# Altium schematic sheet connectors.SchDoc
size A3
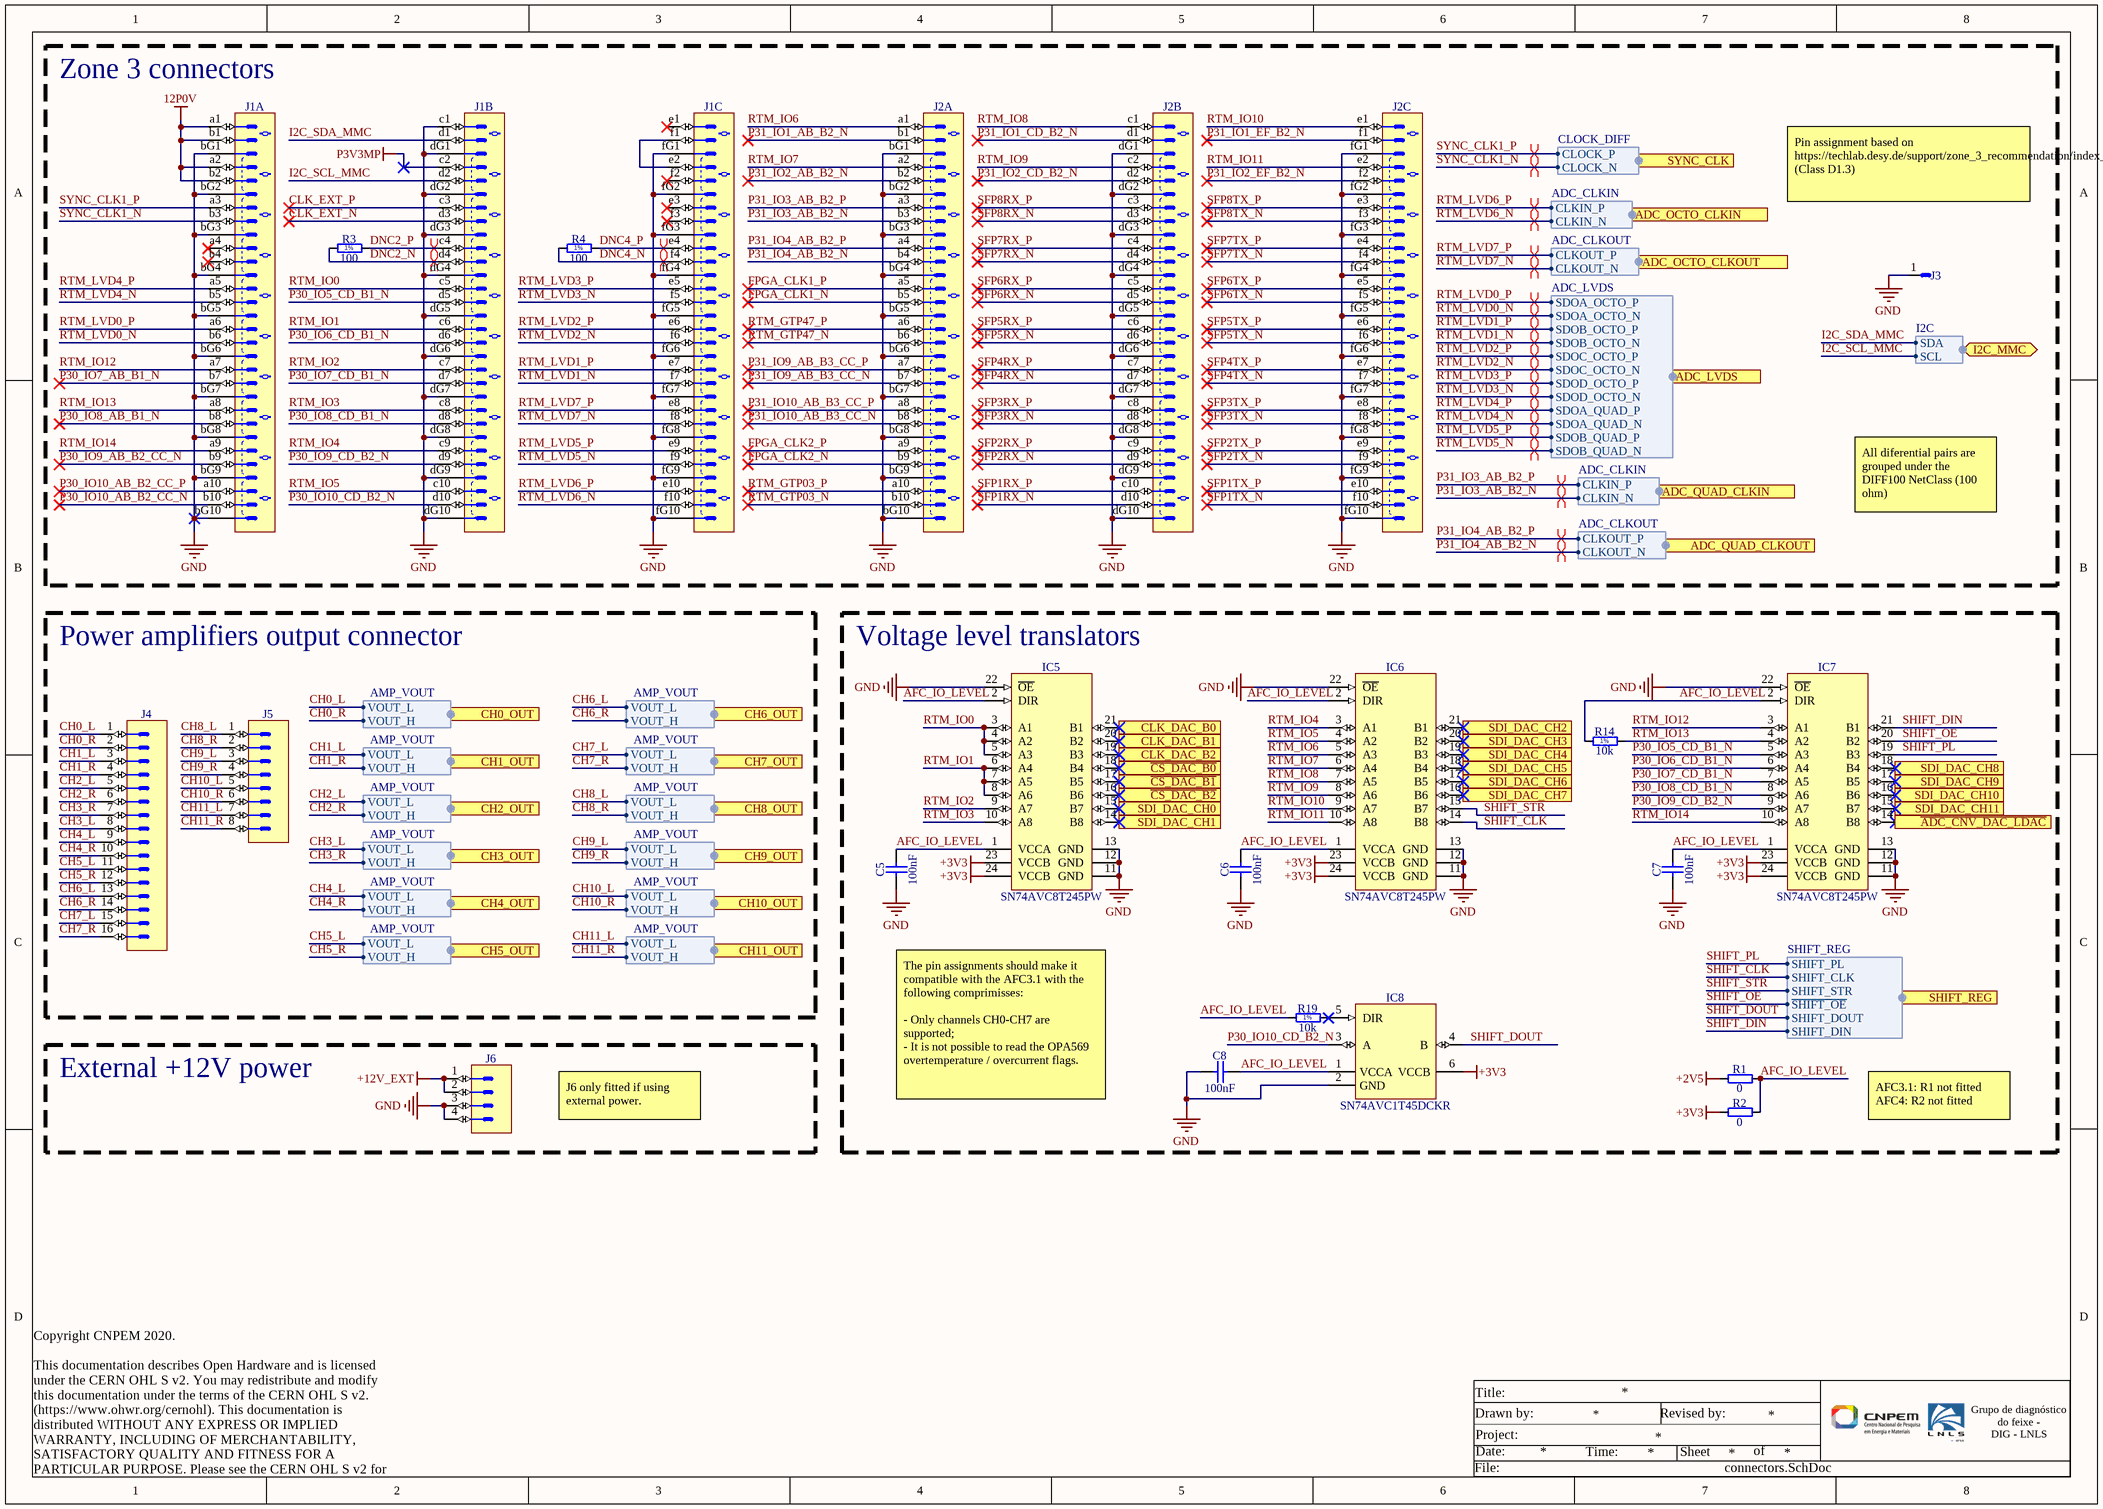
[diagram p0: connectors.SchDoc]

## Parts
C5  100nF  [CAPC1608X87N]
C6  100nF  [CAPC1608X87N]
C7  100nF  [CAPC1608X87N]
C8  100nF  [CAPC1608X87N]
IC5  SN74AVC8T245PW  [SOP65P640X120-24N]
IC6  SN74AVC8T245PW  [SOP65P640X120-24N]
IC7  SN74AVC8T245PW  [SOP65P640X120-24N]
IC8  SN74AVC1T45DCKR  [SOT65P210X110-6N]
J1  Advanced TCA  [TYCO_6469183-1]  (value not drawn)  (parts A,B,C of 3)
J2  Advanced TCA  [TYCO_6469183-1]  (value not drawn)  (parts A,B,C of 3)
J3  (no value)  [TYCO_1469265-1]
J4  Euroblock  [MOLEX_39502-1016]  (value not drawn)
J5  Euroblock  [MOLEX_39502-1008]  (value not drawn)
J6  Euroblock  [MOLEX_39502-1004]  (value not drawn)
R1  0  [RESC1608X55N]
R2  0  [RESC1608X55N]
R3  100  [RESC1608X55N]
R4  100  [RESC1608X55N]
R14  10k  [RESC1608X55N]
R19  10k  [RESC1608X55N]

## Blocks framed on the sheet
Zone 3 connectors: J1-J3 R3 R4
Power amplifiers output connector: J4 J5
Voltage level translators: C5-C8 IC5-IC8 R1 R2 R14 R19
External +12V power: J6

## Ports
ADC_LVDS (harness ADC_LVDS), ADC_OCTO_CLKIN (harness ADC_CLKIN), ADC_OCTO_CLKOUT (harness ADC_CLKOUT), ADC_QUAD_CLKIN (harness ADC_CLKIN), ADC_QUAD_CLKOUT (harness ADC_CLKOUT), CH0_OUT (harness AMP_VOUT), CH1_OUT (harness AMP_VOUT), CH2_OUT (harness AMP_VOUT), CH3_OUT (harness AMP_VOUT), CH4_OUT (harness AMP_VOUT), CH5_OUT (harness AMP_VOUT), CH6_OUT (harness AMP_VOUT), CH7_OUT (harness AMP_VOUT), CH8_OUT (harness AMP_VOUT), CH9_OUT (harness AMP_VOUT), CH10_OUT (harness AMP_VOUT), CH11_OUT (harness AMP_VOUT), CLK_DAC_B0 (out), CLK_DAC_B1 (out), CLK_DAC_B2 (out), I2C_MMC (bidir, harness I2C), SDI_DAC_CH0 (out), SDI_DAC_CH1 (out), SDI_DAC_CH2 (out), SDI_DAC_CH3 (out), SDI_DAC_CH4 (out), SDI_DAC_CH5 (out), SDI_DAC_CH6 (out), SDI_DAC_CH7 (out), SDI_DAC_CH8 (out), SDI_DAC_CH9 (out), SDI_DAC_CH10 (out), SDI_DAC_CH11 (out), SHIFT_REG (out, harness SHIFT_REG), SYNC_CLK (harness CLOCK_DIFF), ~{ADC_CNV_DAC_LDAC} (out), ~{CS_DAC_B0} (out), ~{CS_DAC_B1} (out), ~{CS_DAC_B2} (out)

## Harnesses
CLOCK_DIFF: CLOCK_P, CLOCK_N
I2C: SDA, SCL
AMP_VOUT: VOUT_L, VOUT_H
SHIFT_REG: SHIFT_PL, SHIFT_CLK, SHIFT_STR, ~{SHIFT_OE}, SHIFT_DOUT, SHIFT_DIN
ADC_LVDS: SDOA_OCTO_P, SDOA_OCTO_N, SDOB_OCTO_P, SDOB_OCTO_N, SDOC_OCTO_P, SDOC_OCTO_N, SDOD_OCTO_P, SDOD_OCTO_N, SDOA_QUAD_P, SDOA_QUAD_N, SDOB_QUAD_P, SDOB_QUAD_N
ADC_CLKIN: CLKIN_P, CLKIN_N
ADC_CLKOUT: CLKOUT_P, CLKOUT_N

## Nets
12P0V: J1.a1 J1.a2 J1.b1 J1.b2
+2V5: R1.1
+3V3: IC5.23(VCCB) IC5.24(VCCB) IC6.23(VCCB) IC6.24(VCCB) IC7.23(VCCB) IC7.24(VCCB) IC8.6(VCCB) R2.1
+12V_EXT: J6.1 J6.2
GND: C5.1 C6.1 C7.1 C8.1 IC5.11(GND) IC5.12(GND) IC5.13(GND) IC5.22(~{OE}) IC6.11(GND) IC6.12(GND) IC6.13(GND) IC6.22(~{OE}) IC7.11(GND) IC7.12(GND) IC7.13(GND) IC7.22(~{OE}) IC8.2(GND) J1.bG1 J1.bG2 J1.bG3 J1.bG4 J1.bG5 J1.bG6 J1.bG7 J1.bG8 J1.bG9 J1.bG10 J1.c1 J1.dG1 J1.dG2 J1.dG3 J1.dG4 J1.dG5 J1.dG6 J1.dG7 J1.dG8 J1.dG9 J1.dG10 J1.fG1 J1.fG2 J1.fG3 J1.fG4 J1.fG5 J1.fG6 J1.fG7 J1.fG8 J1.fG9 J1.fG10 J2.bG1 J2.bG2 J2.bG3 J2.bG4 J2.bG5 J2.bG6 J2.bG7 J2.bG8 J2.bG9 J2.bG10 J2.dG1 J2.dG2 J2.dG3 J2.dG4 J2.dG5 J2.dG6 J2.dG7 J2.dG8 J2.dG9 J2.dG10 J2.fG1 J2.fG2 J2.fG3 J2.fG4 J2.fG5 J2.fG6 J2.fG7 J2.fG8 J2.fG9 J2.fG10 J3.1 J6.3 J6.4
P3V3MP: J1.c2
~{ADC_CNV_DAC_LDAC}: IC7.14(B8) ; port ~{ADC_CNV_DAC_LDAC}
AFC_IO_LEVEL: C5.2 C6.2 C7.2 C8.2 IC5.1(VCCA) IC5.2(DIR) IC6.1(VCCA) IC6.2(DIR) IC7.1(VCCA) IC7.2(DIR) IC8.1(VCCA) R1.2 R2.2 R14.1 R19.1
~{CS_DAC_B0}: IC5.18(B4) ; port ~{CS_DAC_B0}
~{CS_DAC_B1}: IC5.17(B5) ; port ~{CS_DAC_B1}
~{CS_DAC_B2}: IC5.16(B6) ; port ~{CS_DAC_B2}
CH0_L: J4.1 ; port CH0_OUT.VOUT_L
CH0_R: J4.2 ; port CH0_OUT.VOUT_H
CH1_L: J4.3 ; port CH1_OUT.VOUT_L
CH1_R: J4.4 ; port CH1_OUT.VOUT_H
CH2_L: J4.5 ; port CH2_OUT.VOUT_L
CH2_R: J4.6 ; port CH2_OUT.VOUT_H
CH3_L: J4.8 ; port CH3_OUT.VOUT_L
CH3_R: J4.7 ; port CH3_OUT.VOUT_H
CH4_L: J4.9 ; port CH4_OUT.VOUT_L
CH4_R: J4.10 ; port CH4_OUT.VOUT_H
CH5_L: J4.11 ; port CH5_OUT.VOUT_L
CH5_R: J4.12 ; port CH5_OUT.VOUT_H
CH6_L: J4.13 ; port CH6_OUT.VOUT_L
CH6_R: J4.14 ; port CH6_OUT.VOUT_H
CH7_L: J4.15 ; port CH7_OUT.VOUT_L
CH7_R: J4.16 ; port CH7_OUT.VOUT_H
CH8_L: J5.1 ; port CH8_OUT.VOUT_L
CH8_R: J5.2 ; port CH8_OUT.VOUT_H
CH9_L: J5.3 ; port CH9_OUT.VOUT_L
CH9_R: J5.4 ; port CH9_OUT.VOUT_H
CH10_L: J5.5 ; port CH10_OUT.VOUT_L
CH10_R: J5.6 ; port CH10_OUT.VOUT_H
CH11_L: J5.7 ; port CH11_OUT.VOUT_L
CH11_R: J5.8 ; port CH11_OUT.VOUT_H
CLK_DAC_B0: IC5.21(B1) ; port CLK_DAC_B0
CLK_DAC_B1: IC5.20(B2) ; port CLK_DAC_B1
CLK_DAC_B2: IC5.19(B3) ; port CLK_DAC_B2
CLK_EXT_N: J1.d3
CLK_EXT_P: J1.c3
DNC2_N: J1.d4 R3.1
DNC2_P: J1.c4 R3.2
DNC4_N: J1.f4 R4.1
DNC4_P: J1.e4 R4.2
FPGA_CLK1_N: J2.b5
FPGA_CLK1_P: J2.a5
FPGA_CLK2_N: J2.b9
FPGA_CLK2_P: J2.a9
I2C_SCL_MMC: J1.d2 ; port I2C_MMC.SCL
I2C_SDA_MMC: J1.d1 ; port I2C_MMC.SDA
P30_IO5_CD_B1_N: IC7.5(A3) J1.d5
P30_IO6_CD_B1_N: IC7.6(A4) J1.d6
P30_IO7_AB_B1_N: J1.b7
P30_IO7_CD_B1_N: IC7.7(A5) J1.d7
P30_IO8_AB_B1_N: J1.b8
P30_IO8_CD_B1_N: IC7.8(A6) J1.d8
P30_IO9_AB_B2_CC_N: J1.b9
P30_IO9_CD_B2_N: IC7.9(A7) J1.d9
P30_IO10_AB_B2_CC_N: J1.b10
P30_IO10_AB_B2_CC_P: J1.a10
P30_IO10_CD_B2_N: IC8.3(A) J1.d10
P31_IO1_AB_B2_N: J2.b1
P31_IO1_CD_B2_N: J2.d1
P31_IO1_EF_B2_N: J2.f1
P31_IO2_AB_B2_N: J2.b2
P31_IO2_CD_B2_N: J2.d2
P31_IO2_EF_B2_N: J2.f2
P31_IO3_AB_B2_N: J2.b3 ; port ADC_QUAD_CLKIN.CLKIN_N
P31_IO3_AB_B2_P: J2.a3 ; port ADC_QUAD_CLKIN.CLKIN_P
P31_IO4_AB_B2_N: J2.b4 ; port ADC_QUAD_CLKOUT.CLKOUT_N
P31_IO4_AB_B2_P: J2.a4 ; port ADC_QUAD_CLKOUT.CLKOUT_P
P31_IO9_AB_B3_CC_N: J2.b7
P31_IO9_AB_B3_CC_P: J2.a7
P31_IO10_AB_B3_CC_N: J2.b8
P31_IO10_AB_B3_CC_P: J2.a8
RTM_GTP03_N: J2.b10
RTM_GTP03_P: J2.a10
RTM_GTP47_N: J2.b6
RTM_GTP47_P: J2.a6
RTM_IO0: IC5.3(A1) IC5.4(A2) IC5.5(A3) J1.c5
RTM_IO1: IC5.6(A4) IC5.7(A5) IC5.8(A6) J1.c6
RTM_IO2: IC5.9(A7) J1.c7
RTM_IO3: IC5.10(A8) J1.c8
RTM_IO4: IC6.3(A1) J1.c9
RTM_IO5: IC6.4(A2) J1.c10
RTM_IO6: IC6.5(A3) J2.a1
RTM_IO7: IC6.6(A4) J2.a2
RTM_IO8: IC6.7(A5) J2.c1
RTM_IO9: IC6.8(A6) J2.c2
RTM_IO10: IC6.9(A7) J2.e1
RTM_IO11: IC6.10(A8) J2.e2
RTM_IO12: IC7.3(A1) J1.a7
RTM_IO13: IC7.4(A2) J1.a8 R14.2
RTM_IO14: IC7.10(A8) J1.a9
RTM_LVD0_N: J1.b6 ; port ADC_LVDS.SDOA_OCTO_N
RTM_LVD0_P: J1.a6 ; port ADC_LVDS.SDOA_OCTO_P
RTM_LVD1_N: J1.f7 ; port ADC_LVDS.SDOB_OCTO_N
RTM_LVD1_P: J1.e7 ; port ADC_LVDS.SDOB_OCTO_P
RTM_LVD2_N: J1.f6 ; port ADC_LVDS.SDOC_OCTO_N
RTM_LVD2_P: J1.e6 ; port ADC_LVDS.SDOC_OCTO_P
RTM_LVD3_N: J1.f5 ; port ADC_LVDS.SDOD_OCTO_N
RTM_LVD3_P: J1.e5 ; port ADC_LVDS.SDOD_OCTO_P
RTM_LVD4_N: J1.b5 ; port ADC_LVDS.SDOA_QUAD_N
RTM_LVD4_P: J1.a5 ; port ADC_LVDS.SDOA_QUAD_P
RTM_LVD5_N: J1.f9 ; port ADC_LVDS.SDOB_QUAD_N
RTM_LVD5_P: J1.e9 ; port ADC_LVDS.SDOB_QUAD_P
RTM_LVD6_N: J1.f10 ; port ADC_OCTO_CLKIN.CLKIN_N
RTM_LVD6_P: J1.e10 ; port ADC_OCTO_CLKIN.CLKIN_P
RTM_LVD7_N: J1.f8 ; port ADC_OCTO_CLKOUT.CLKOUT_N
RTM_LVD7_P: J1.e8 ; port ADC_OCTO_CLKOUT.CLKOUT_P
~{SHIFT_OE}: IC7.20(B2) ; port SHIFT_REG.~{SHIFT_OE}
SDI_DAC_CH0: IC5.15(B7) ; port SDI_DAC_CH0
SDI_DAC_CH1: IC5.14(B8) ; port SDI_DAC_CH1
SDI_DAC_CH2: IC6.21(B1) ; port SDI_DAC_CH2
SDI_DAC_CH3: IC6.20(B2) ; port SDI_DAC_CH3
SDI_DAC_CH4: IC6.19(B3) ; port SDI_DAC_CH4
SDI_DAC_CH5: IC6.18(B4) ; port SDI_DAC_CH5
SDI_DAC_CH6: IC6.17(B5) ; port SDI_DAC_CH6
SDI_DAC_CH7: IC6.16(B6) ; port SDI_DAC_CH7
SDI_DAC_CH8: IC7.18(B4) ; port SDI_DAC_CH8
SDI_DAC_CH9: IC7.17(B5) ; port SDI_DAC_CH9
SDI_DAC_CH10: IC7.16(B6) ; port SDI_DAC_CH10
SDI_DAC_CH11: IC7.15(B7) ; port SDI_DAC_CH11
SFP1RX_N: J2.d10
SFP1RX_P: J2.c10
SFP1TX_N: J2.f10
SFP1TX_P: J2.e10
SFP2RX_N: J2.d9
SFP2RX_P: J2.c9
SFP2TX_N: J2.f9
SFP2TX_P: J2.e9
SFP3RX_N: J2.d8
SFP3RX_P: J2.c8
SFP3TX_N: J2.f8
SFP3TX_P: J2.e8
SFP4RX_N: J2.d7
SFP4RX_P: J2.c7
SFP4TX_N: J2.f7
SFP4TX_P: J2.e7
SFP5RX_N: J2.d6
SFP5RX_P: J2.c6
SFP5TX_N: J2.f6
SFP5TX_P: J2.e6
SFP6RX_N: J2.d5
SFP6RX_P: J2.c5
SFP6TX_N: J2.f5
SFP6TX_P: J2.e5
SFP7RX_N: J2.d4
SFP7RX_P: J2.c4
SFP7TX_N: J2.f4
SFP7TX_P: J2.e4
SFP8RX_N: J2.d3
SFP8RX_P: J2.c3
SFP8TX_N: J2.f3
SFP8TX_P: J2.e3
SHIFT_CLK: IC6.14(B8) ; port SHIFT_REG.SHIFT_CLK
SHIFT_DIN: IC7.21(B1) ; port SHIFT_REG.SHIFT_DIN
SHIFT_DOUT: IC8.4(B) ; port SHIFT_REG.SHIFT_DOUT
SHIFT_PL: IC7.19(B3) ; port SHIFT_REG.SHIFT_PL
SHIFT_STR: IC6.15(B7) ; port SHIFT_REG.SHIFT_STR
SYNC_CLK1_N: J1.b3 ; port SYNC_CLK.CLOCK_N
SYNC_CLK1_P: J1.a3 ; port SYNC_CLK.CLOCK_P
NetIC8_5: IC8.5(DIR) R19.2
NetJ1_e2: J1.e2 J1.f1

Not connected (* = marked no-connect by the designer): J1 a4* b4* e1* e3* f2* f3*

## Layout directives
differential pair; differential pair class DIFF100: DNC2_N, DNC2_P, DNC4_N, DNC4_P, P31_IO3_AB_B2_N, P31_IO3_AB_B2_P, P31_IO4_AB_B2_N, P31_IO4_AB_B2_P, RTM_LVD0_N, RTM_LVD0_P, RTM_LVD1_N, RTM_LVD1_P, RTM_LVD2_N, RTM_LVD2_P, RTM_LVD3_N, RTM_LVD3_P, RTM_LVD4_N, RTM_LVD4_P, RTM_LVD5_N, RTM_LVD5_P, RTM_LVD6_N, RTM_LVD6_P, RTM_LVD7_N, RTM_LVD7_P, SYNC_CLK1_N, SYNC_CLK1_P

## Notes on the sheet
- Pin assignment based on https://techlab.desy.de/support/zone_3_recommendation/index_eng.html
  (Class D1.3)
- All diferential pairs are grouped under the DIFF100 NetClass (100 ohm)
- J6 only fitted if using external power.
- The pin assignments should make it compatible with the AFC3.1 with the following comprimisses:
  - Only channels CH0-CH7 are supported;
  - It is not possible to read the OPA569 overtemperature / overcurrent flags.
- AFC3.1: R1 not fitted
  AFC4: R2 not fitted
- Title:
- Date:
- Project:
- Drawn by:
- Time:
- Revised by:
- Sheet
- of
- Grupo de diagnóstico do feixe -
  DIG - LNLS
- Copyright CNPEM 2020.
  This documentation describes Open Hardware and is licensed under the CERN OHL S v2. You may redistribute and modify this documentation under the terms of the CERN OHL S v2. (https://www.ohwr.org/cernohl). This documentation is distributed WITHOUT ANY EXPRESS OR IMPLIED WARRANTY, INCLUDING OF MERCHANTABILITY, SATISFACTORY QUALITY AND FITNESS FOR A PARTICULAR PURPOSE. Please see the CERN OHL S v2 for applicable conditions.
- File:
- (in symbol R0603_10K_1%_0.1W_100PPM) 1%
- (in symbol R0603_100R_1%_0.1W_100PPM) 1%

## Library data of the parts
C5-C8 = CC0603_100NF_50V_10%_X7R: Non-polarised capacitor; Part Description: SMD Multilayer Chip Ceramic Capacitor; Manufacturer: GENERIC; Manufacturer1 Part Number: 223858615649; Voltage: 50V; TC: X7R; Tolerance: ±10%; Part Number: CC0603_100NF_50V_10%_X7R; Component Kind: Standard; Component Type: Standard; Pin Count: 2; Value: 100nF; Status: Preferred; Manufacturer Part Number: CC0603_100NF_50V_10%_X7R; Case: 0603; Mounted: Yes; Socket: No; SMD: Yes; Sense: No; Manufacturer1 Example: PHYCOMP; Manufacturer1 ComponentHeight: 0.87mm; HelpURL: \\cern.ch\dfs\Applications\Altium\Datasheets\CC0603_X7R_PHYCOMP.pdf; Author: CERN DEM JLC; CreateDate: 03/12/2007; LatestRevisionDate: 03/12/2007
IC5-IC7 = SN74AVC8T245PW: 8-Bit Dual-Supply Bus Transceiver With Configurable Voltage Translation and 3-State Outputs; Manufacturer: TEXAS INSTRUMENTS; PressFit: No; Bonding: No; Part Number: SN74AVC8T245PW; Component Kind: Standard; Component Type: Standard; Device: SN74AVC8T245PW; PackageDescription: SOP, 0.65mm Pitch; 24 Pin, 4.40mm W X 7.80mm L X 1.20mm H Body, IPC Medium Density; Part Description: 8-Bit Dual-Supply Bus Transceiver With Configurable Voltage Translation and 3-State Outputs; Manufacturer Part Number: SN74AVC8T245PW; Pin Count: 24; Case: TSSOP24; Mounted: Yes; Socket: No; SMD: Yes; Sense: No; ComponentHeight: 1.2mm; Author: CERN DEM JLC; HelpURL: \\cern.ch\dfs\Applications\Altium\Datasheets\SN74AVC8T245PW.pdf; CreateDate: 07/03/2012; LatestRevisionDate: 07/03/2012
IC8 = SN74AVC1T45DCKR: Single-Bit Dual-Supply Bus Transceiver; Part Description: Single-Bit Dual-Supply Bus Transceiver with Configurable Voltage Translation and 3-State Outputs; Manufacturer: TEXAS INSTRUMENTS; PressFit: No; Bonding: No; Part Number: SN74AVC1T45DCKR; Component Kind: Standard; Component Type: Standard; Device: SN74AVC1T45DCKR; PackageDescription: SOT363, SC70-6, SOT, 0.65mm Pitch, 6 pin, 1.25mm W X 2.00mm L X 1.10mm H, IPC Medium Density; Manufacturer Part Number: SN74AVC1T45DCKR; Pin Count: 6; Case: SOT363; Mounted: Yes; Socket: No; SMD: Yes; Sense: No; ComponentHeight: 1.1mm; Author: CERN DEM JLC; HelpURL: \\cern.ch\dfs\Applications\Altium\Datasheets\SN74AVC1T45DCKR.pdf; CreateDate: 07/07/2014; LatestRevisionDate: 07/07/2014
J1 J2 = TYCO_6469183-1: Connector 60 ATCA Male 30 Pairs (60 Signals) + 3x10 Ground; Part Description: 60 Positions, Pitch 2.5mm,  Advanced TCA, Z-PACK HM-Zd Right Angle Press Fit Header; Manufacturer: TYCO ELECTRONICS; Part Number: TYCO_6469183-1; Component Kind: Standard; Component Type: Standard; Pin Count: 90; Family: Advanced TCA; Mounted: Yes; Socket: No; SMD: No; PressFit: Yes; Sense: No; Status: None; Manufacturer Part Number: 6469183-1; ComponentHeight: 13.31mm; HelpURL: \\cern.ch\dfs\Applications\Altium\Datasheets\TYCO_6469183-1.pdf; Author: CERN DEM JLC; CreateDate: 28/08/2013; LatestRevisionDate: 28/08/2013
J3 = TYCO_1469265-1: Single Pin Male; Part Description: Universal Right Angle Male Power Module Guide (keyed); Manufacturer: TYCO ELECTRONICS; PressFit: No; Part Number: TYCO_1469265-1; Component Kind: Standard; Component Type: Standard; Pin Count: 1; Mounted: Yes; Socket: No; SMD: No; Sense: No; Status: None; Manufacturer Part Number: 1469265-1; ComponentHeight: 9.78mm; HelpURL: \\cern.ch\dfs\Applications\Altium\Datasheets\TYCO_1469265-1.pdf; Author: CERN DEM JLC; CreateDate: 28/08/2013; LatestRevisionDate: 28/08/2013
J4 = MOLEX_39502-1016: Connector 16 Male; Part Description: 3.50mm Pitch Eurostyle Horizontal PCB Header, 16 Circuits; Manufacturer: MOLEX; Manufacturer Part Number: 395021016; PressFit: No; Part Number: MOLEX_39502-1016; Component Kind: Standard; Component Type: Standard; Pin Count: 16; Family: Euroblock; Mounted: Yes; Socket: No; SMD: No; Sense: No; Status: None; ComponentHeight: 6.9mm; Author: LNLS DIG AFG; CreateDate: 09/07/2020; LatestRevisionDate: 09/07/2020
J5 = MOLEX_39502-1008: Connector 8 Male; Part Description: 3.50mm Pitch Eurostyle Horizontal PCB Header, 8 Circuits; Manufacturer: MOLEX; Manufacturer Part Number: 395021008; PressFit: No; Part Number: MOLEX_39502-1008; Component Kind: Standard; Component Type: Standard; Pin Count: 8; Family: Euroblock; Mounted: Yes; Socket: No; SMD: No; Sense: No; Status: None; ComponentHeight: 6.9mm; Author: LNLS DIG AFG; CreateDate: 09/07/2020; LatestRevisionDate: 09/07/2020
J6 = MOLEX_39502-1004: Connector 4 Male; Part Description: 3.50mm Pitch Eurostyle Horizontal PCB Header, 4 Circuits; Manufacturer: MOLEX; Manufacturer Part Number: 395021004; PressFit: No; Part Number: MOLEX_39502-1004; Component Kind: Standard; Component Type: Standard; Pin Count: 4; Family: Euroblock; Mounted: Yes; Socket: No; SMD: No; Sense: No; Status: None; ComponentHeight: 6.9mm; Author: LNLS DIG AFG; CreateDate: 09/07/2020; LatestRevisionDate: 09/07/2020
R1 R2 = R0603_0R_JUMPER: Resistor; Part Description: 1A (0.05R Max DC Resistance) Zero Ohm Jumper; Manufacturer: GENERIC; Manufacturer1 Part Number: NRC06Z0; Part Number: R0603_0R_JUMPER; Component Kind: Standard; Component Type: Standard; Pin Count: 2; Value: 0; Status: Preferred; Manufacturer Part Number: R0603_0R_JUMPER; Case: 0603; Mounted: Yes; Sense: No; Socket: No; SMD: Yes; Manufacturer1 Example: NIC COMPONENT; Manufacturer1 ComponentHeight: 0.55mm; HelpURL: \\cern.ch\dfs\Applications\Altium\Datasheets\R0603_NIC_NRC.pdf; Author: CERN DEM JLC; CreateDate: 03/12/2007; LatestRevisionDate: 13/03/2008
R3 R4 = R0603_100R_1%_0.1W_100PPM: Resistor - 1%; Part Description: General Purpose Thick Film Chip Resistor; Manufacturer: GENERIC; Manufacturer1 Part Number: NRC06F4700TRF; Power: 0.1W; TC: ±100ppm/°C; Part Number: R0603_100R_1%_0.1W_100PPM; Component Kind: Standard; Component Type: Standard; Pin Count: 2; Value: 100; Status: Preferred; Tolerance: ±1%; Manufacturer Part Number: R0603_100R_1%_0.1W_100PPM; Case: 0603; Mounted: Yes; Socket: No; SMD: Yes; Manufacturer1 Example: NIC COMPONENT; Manufacturer1 ComponentHeight: 0.55mm; HelpURL: \\cern.ch\dfs\Applications\Altium\Datasheets\R0603_NIC_NRC.pdf; Author: CERN DEM JLC; CreateDate: 03/12/2007; LatestRevisionDate: 13/03/2008; Sense: No
R14 R19 = R0603_10K_1%_0.1W_100PPM: Resistor - 1%; Part Description: General Purpose Thick Film Chip Resistor; Manufacturer: GENERIC; Manufacturer1 Part Number: NRC06F1002TRF; Power: 0.1W; TC: ±100ppm/°C; Part Number: R0603_10K_1%_0.1W_100PPM; Component Kind: Standard; Component Type: Standard; Pin Count: 2; Value: 10k; Status: Preferred; Tolerance: ±1%; Manufacturer Part Number: R0603_10K_1%_0.1W_100PPM; Case: 0603; Mounted: Yes; Sense: No; Socket: No; SMD: Yes; Manufacturer1 Example: NIC COMPONENT; Manufacturer1 ComponentHeight: 0.55mm; HelpURL: \\cern.ch\dfs\Applications\Altium\Datasheets\R0603_NIC_NRC.pdf; Author: CERN DEM JLC; CreateDate: 03/12/2007; LatestRevisionDate: 13/03/2008